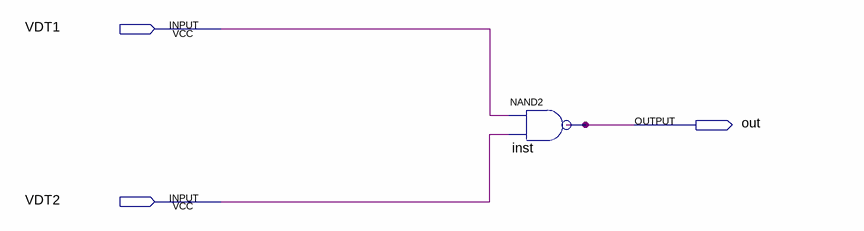
[diagram p0: schematic sheet]
// Quartus schematic assignment3.bdf as structural Verilog: 1 symbols, 3 pins
module assignment3 (
  input  VDT1,
  input  VDT2,
  output out
);

  nand inst (out, VDT1, VDT2);
endmodule
